# Altium schematic sheet PowerRegulation.SchDoc
size A4
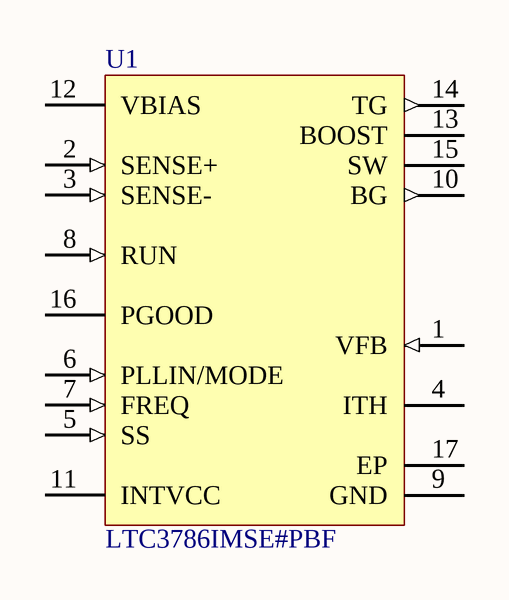
[diagram p0: PowerRegulation.SchDoc]

## Parts
U1  LTC3786IMSE#PBF  [LT-MSE-16-EDP_N]

## Nets

Not connected (* = marked no-connect by the designer): U1 1(VFB) 2(SENSE+) 3(SENSE-) 4(ITH) 5(SS) 6(PLLIN/MODE) 7(FREQ) 8(RUN) 9(GND) 10(BG) 11(INTVCC) 12(VBIAS) 13(BOOST) 14(TG) 15(SW) 16(PGOOD) 17(EP)

## Library data of the parts
U1 = LTC3786IMSE#PBF: Sync Boost Controller, Low 55 uA IQ, 16-pin SOP (MSE-16-EDP), -40 to 125 degC, Pb-Free; Manufacturer: Linear Technology; Frequency Sync Range: 75kHz - 850kHz; Number of Outputs: 1; DatasheetVersion: Rev. A; PackageVersion: Rev. F, 05/2013; PackageReference: MSE-16; PackageDescription: 16-Pin Plastic MSOP, Exposed Die Pad, Body 4.039 x 3 mm, Pitch 0.5 mm; Supplier 1: Digi-Key; Supplier Part Number 1: LTC3786IMSE#PBF-ND; Supplier 2: Newark; Supplier Part Number 2: 13T3897; RoHS: TRUE; Mounting Technology: Surface Mount; PartNumber: LTC3786IMSE#PBF; ComponentLink1Description: Manufacturer URL; ComponentLink1URL: http://www.linear.com/; ComponentLink2Description: Datasheet; ComponentLink2URL: http://cds.linear.com/docs/en/datasheet/3786fa.pdf; ComponentLink3Description: Package Specification; ComponentLink3URL: http://cds.linear.com/docs/en/packaging/05081667_F_MSE16.pdf